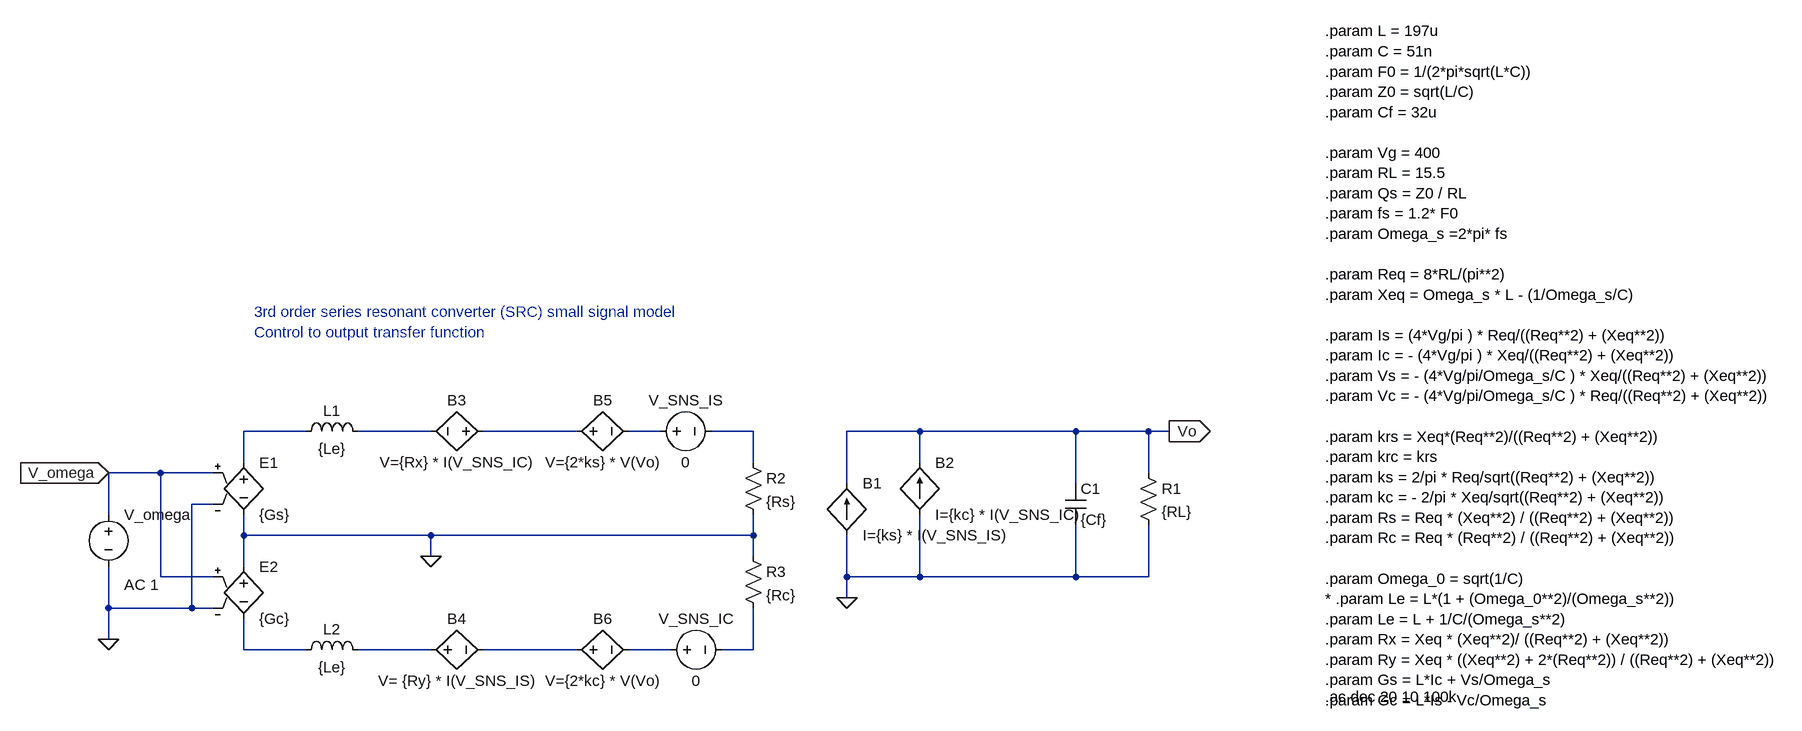
[diagram p0: schematic src_3rd_eq_vo-omega.asc]
src_3rd_eq_vo-omega.asc, the LTspice schematic file:
Version 4
SHEET 1 988 1232
WIRE -1280 672 -1376 672
WIRE -1088 672 -1200 672
WIRE -864 672 -1008 672
WIRE -736 672 -784 672
WIRE -592 672 -656 672
WIRE -336 672 -448 672
WIRE -96 672 -336 672
WIRE 16 672 -96 672
WIRE 48 672 16 672
WIRE -1376 720 -1376 672
WIRE -592 720 -592 672
WIRE -336 720 -336 672
WIRE -1504 736 -1584 736
WIRE -1424 736 -1504 736
WIRE 16 736 16 672
WIRE -448 752 -448 672
WIRE -96 752 -96 672
WIRE -1424 784 -1456 784
WIRE -1584 800 -1584 736
WIRE -1376 832 -1376 800
WIRE -1088 832 -1376 832
WIRE -592 832 -592 800
WIRE -592 832 -1088 832
WIRE -1088 864 -1088 832
WIRE -592 864 -592 832
WIRE -1376 880 -1376 832
WIRE -1504 896 -1504 736
WIRE -1424 896 -1504 896
WIRE -448 896 -448 832
WIRE -336 896 -336 800
WIRE -336 896 -448 896
WIRE -96 896 -96 816
WIRE -96 896 -336 896
WIRE 16 896 16 816
WIRE 16 896 -96 896
WIRE -448 928 -448 896
WIRE -1584 944 -1584 880
WIRE -1456 944 -1456 784
WIRE -1456 944 -1584 944
WIRE -1424 944 -1456 944
WIRE -1584 992 -1584 944
WIRE -1376 1008 -1376 960
WIRE -1280 1008 -1376 1008
WIRE -1088 1008 -1200 1008
WIRE -864 1008 -1008 1008
WIRE -720 1008 -784 1008
WIRE -592 1008 -592 944
WIRE -592 1008 -640 1008
FLAG -1088 864 0
FLAG -1584 992 0
FLAG -448 928 0
FLAG 48 672 Vo
IOPIN 48 672 Out
FLAG -1584 736 V_omega
IOPIN -1584 736 In
SYMBOL res 0 720 R0
SYMATTR InstName R1
SYMATTR Value {RL}
SYMBOL cap -112 752 R0
SYMATTR InstName C1
SYMATTR Value {Cf}
SYMBOL bi2 -448 752 R0
SYMATTR InstName B1
SYMATTR Value I={ks} * I(V_SNS_IS)
SYMBOL bi2 -336 720 R0
SYMATTR InstName B2
SYMATTR Value I={kc} * I(V_SNS_IC)
SYMBOL voltage -1584 784 R0
WINDOW 123 24 124 Left 2
WINDOW 39 0 0 Left 2
SYMATTR Value2 AC 1
SYMATTR InstName V_omega
SYMATTR Value ""
SYMBOL e -1376 704 R0
SYMATTR InstName E1
SYMATTR Value {Gs}
SYMBOL e -1376 864 R0
SYMATTR InstName E2
SYMATTR Value {Gc}
SYMBOL ind -1296 688 R270
WINDOW 0 32 56 VTop 2
WINDOW 3 5 56 VBottom 2
SYMATTR InstName L1
SYMATTR Value {Le}
SYMBOL bv -992 672 R90
WINDOW 0 -32 56 VBottom 2
WINDOW 3 32 56 VTop 2
SYMATTR InstName B3
SYMATTR Value V={Rx} * I(V_SNS_IC)
SYMBOL ind -1296 1024 R270
WINDOW 0 32 56 VTop 2
WINDOW 3 5 56 VBottom 2
SYMATTR InstName L2
SYMATTR Value {Le}
SYMBOL bv -1104 1008 R270
WINDOW 0 32 56 VTop 2
WINDOW 3 -32 56 VBottom 2
SYMATTR InstName B4
SYMATTR Value V= {Ry} * I(V_SNS_IS)
SYMBOL res -608 704 R0
SYMATTR InstName R2
SYMATTR Value {Rs}
SYMBOL res -608 848 R0
SYMATTR InstName R3
SYMATTR Value {Rc}
SYMBOL voltage -736 1008 R270
WINDOW 0 32 56 VTop 2
WINDOW 3 -32 56 VBottom 2
SYMATTR InstName V_SNS_IC
SYMATTR Value 0
SYMBOL voltage -752 672 R270
WINDOW 0 32 56 VTop 2
WINDOW 3 -32 56 VBottom 2
SYMATTR InstName V_SNS_IS
SYMATTR Value 0
SYMBOL bv -880 672 R270
WINDOW 0 32 56 VTop 2
WINDOW 3 -32 56 VBottom 2
SYMATTR InstName B5
SYMATTR Value V={2*ks} * V(Vo)
SYMBOL bv -880 1008 R270
WINDOW 0 32 56 VTop 2
WINDOW 3 -32 56 VBottom 2
SYMATTR InstName B6
SYMATTR Value V={2*kc} * V(Vo)
TEXT 288 56 Left 2 !.param L = 197u\n.param C = 51n\n.param F0 = 1/(2*pi*sqrt(L*C))\n.param Z0 = sqrt(L/C)\n.param Cf = 32u\n \n.param Vg = 400\n.param RL = 15.5\n.param Qs = Z0 / RL\n.param fs = 1.2* F0\n.param Omega_s =2*pi* fs\n \n.param Req = 8*RL/(pi**2)\n.param Xeq = Omega_s * L - (1/Omega_s/C)\n \n.param Is = (4*Vg/pi ) * Req/((Req**2) + (Xeq**2))\n.param Ic = - (4*Vg/pi ) * Xeq/((Req**2) + (Xeq**2))\n.param Vs = - (4*Vg/pi/Omega_s/C ) * Xeq/((Req**2) + (Xeq**2))\n.param Vc = - (4*Vg/pi/Omega_s/C ) * Req/((Req**2) + (Xeq**2))\n \n.param krs = Xeq*(Req**2)/((Req**2) + (Xeq**2))\n.param krc = krs\n.param ks = 2/pi * Req/sqrt((Req**2) + (Xeq**2))\n.param kc = - 2/pi * Xeq/sqrt((Req**2) + (Xeq**2))\n.param Rs = Req * (Xeq**2) / ((Req**2) + (Xeq**2))\n.param Rc = Req * (Req**2) / ((Req**2) + (Xeq**2))\n \n.param Omega_0 = sqrt(1/C)\n* .param Le = L*(1 + (Omega_0**2)/(Omega_s**2))\n.param Le = L + 1/C/(Omega_s**2)\n.param Rx = Xeq * (Xeq**2)/ ((Req**2) + (Xeq**2))\n.param Ry = Xeq * ((Xeq**2) + 2*(Req**2)) / ((Req**2) + (Xeq**2))\n.param Gs = L*Ic + Vs/Omega_s\n.param Gc = L*Is - Vc/Omega_s
TEXT 288 1080 Left 2 !.ac dec 20 10 100k
TEXT -1360 488 Left 2 ;3rd order series resonant converter (SRC) small signal model\nControl to output transfer function

The netlist it stands for:
* src_3rd_eq_vo-omega.asc
R1 Vo 0 {RL}
C1 Vo 0 {Cf}
B1 0 Vo I={ks} * I(V_SNS_IS)
B2 0 Vo I={kc} * I(V_SNS_IC)
V_omega V_omega 0 AC 1
E1 N001 0 V_omega 0 {Gs}
E2 0 N006 V_omega 0 {Gc}
L1 N001 N002 {Le}
B3 N003 N002 V={Rx} * I(V_SNS_IC)
L2 N006 N007 {Le}
B4 N007 N008 V= {Ry} * I(V_SNS_IS)
R2 N005 0 {Rs}
R3 0 N010 {Rc}
V_SNS_IC N009 N010 0
V_SNS_IS N004 N005 0
B5 N003 N004 V={2*ks} * V(Vo)
B6 N008 N009 V={2*kc} * V(Vo)
.param L = 197u
.param C = 51n
.param F0 = 1/(2*pi*sqrt(L*C))
.param Z0 = sqrt(L/C)
.param Cf = 32u
.param Vg = 400
.param RL = 15.5
.param Qs = Z0 / RL
.param fs = 1.2* F0
.param Omega_s =2*pi* fs
.param Req = 8*RL/(pi**2)
.param Xeq = Omega_s * L - (1/Omega_s/C)
.param Is = (4*Vg/pi ) * Req/((Req**2) + (Xeq**2))
.param Ic = - (4*Vg/pi ) * Xeq/((Req**2) + (Xeq**2))
.param Vs = - (4*Vg/pi/Omega_s/C ) * Xeq/((Req**2) + (Xeq**2))
.param Vc = - (4*Vg/pi/Omega_s/C ) * Req/((Req**2) + (Xeq**2))
.param krs = Xeq*(Req**2)/((Req**2) + (Xeq**2))
.param krc = krs
.param ks = 2/pi * Req/sqrt((Req**2) + (Xeq**2))
.param kc = - 2/pi * Xeq/sqrt((Req**2) + (Xeq**2))
.param Rs = Req * (Xeq**2) / ((Req**2) + (Xeq**2))
.param Rc = Req * (Req**2) / ((Req**2) + (Xeq**2))
.param Omega_0 = sqrt(1/C)
* .param Le = L*(1 + (Omega_0**2)/(Omega_s**2))
.param Le = L + 1/C/(Omega_s**2)
.param Rx = Xeq * (Xeq**2)/ ((Req**2) + (Xeq**2))
.param Ry = Xeq * ((Xeq**2) + 2*(Req**2)) / ((Req**2) + (Xeq**2))
.param Gs = L*Ic + Vs/Omega_s
.param Gc = L*Is - Vc/Omega_s
.ac dec 20 10 100k
* 3rd order series resonant converter (SRC) small signal model
* Control to output transfer function
.backanno
.end